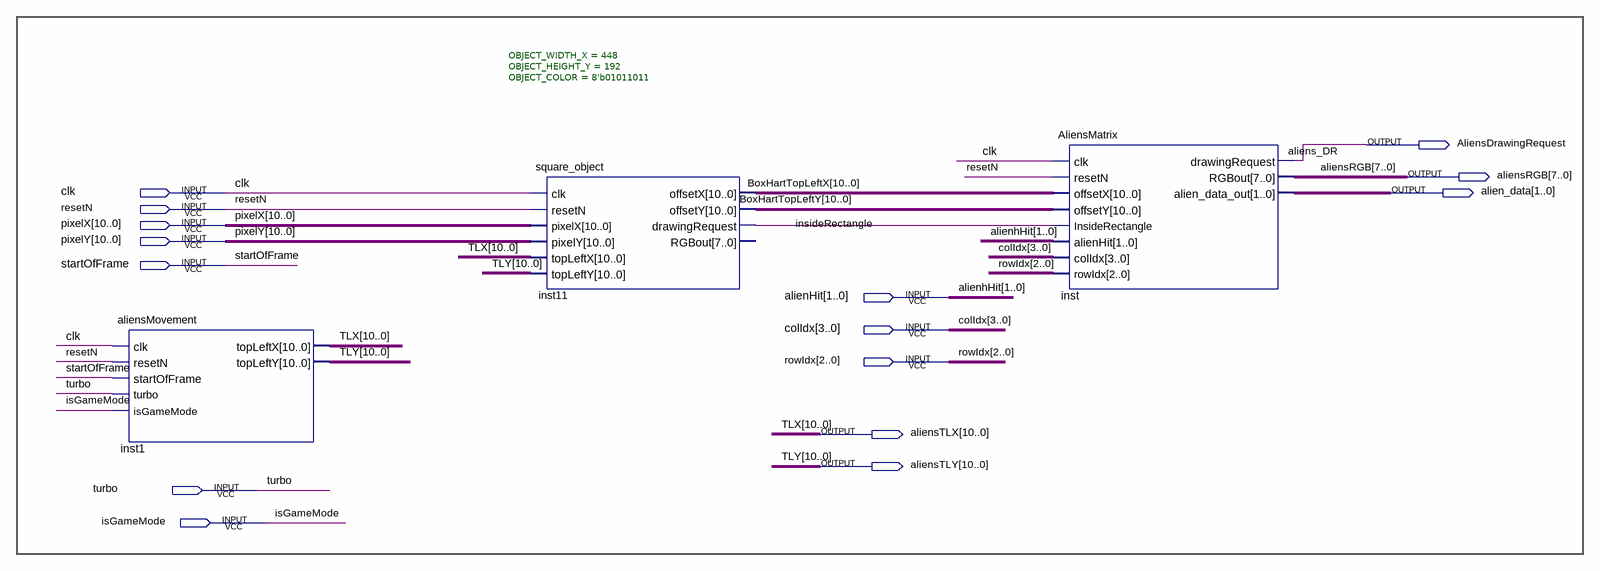
[diagram p0: schematic sheet]
// Quartus schematic AliensController.bdf as structural Verilog: 3 symbols, 15 pins
module AliensController (
  input  clk,
  input  resetN,
  input  [10:0] pixelX,
  input  [10:0] pixelY,
  input  startOfFrame,
  input  [1:0] alienHit,
  input  [3:0] colIdx,
  input  [2:0] rowIdx,
  input  turbo,
  input  isGameMode,
  output AliensDrawingRequest,
  output [7:0] aliensRGB,
  output [1:0] alien_data,
  output [10:0] aliensTLX,
  output [10:0] aliensTLY
);

  wire insideRectangle;
  wire [10:0] BoxHartTopLeftX, BoxHartTopLeftY;

  aliensMovement inst1 (
    .clk(clk), .resetN(resetN), .startOfFrame(startOfFrame), .turbo(turbo), .isGameMode(isGameMode),
    .topLeftX(aliensTLX), .topLeftY(aliensTLY));
  square_object #(.OBJECT_WIDTH_X(448), .OBJECT_HEIGHT_Y(192), .OBJECT_COLOR(8'b01011011)) inst11 (
    .clk(clk), .resetN(resetN), .pixelX(pixelX), .pixelY(pixelY), .topLeftX(aliensTLX), .topLeftY(aliensTLY),
    .offsetX(BoxHartTopLeftX), .offsetY(BoxHartTopLeftY), .drawingRequest(insideRectangle));  // open: RGBout
  AliensMatrix inst (
    .clk(clk), .resetN(resetN), .offsetX(BoxHartTopLeftX), .offsetY(BoxHartTopLeftY),
    .InsideRectangle(insideRectangle), .alienHit(alienHit), .colIdx(colIdx), .rowIdx(rowIdx),
    .drawingRequest(AliensDrawingRequest), .RGBout(aliensRGB), .alien_data_out(alien_data));

  // Other names for the same wires on the sheet: alienhHit[1:0] = alienHit; aliens_DR = AliensDrawingRequest;
  //   TLX[10:0] = aliensTLX; TLY[10:0] = aliensTLY
endmodule
